# EAGLE design Termo-Relay (EAGLE 8.5.2)

## Sheet 1 of 2
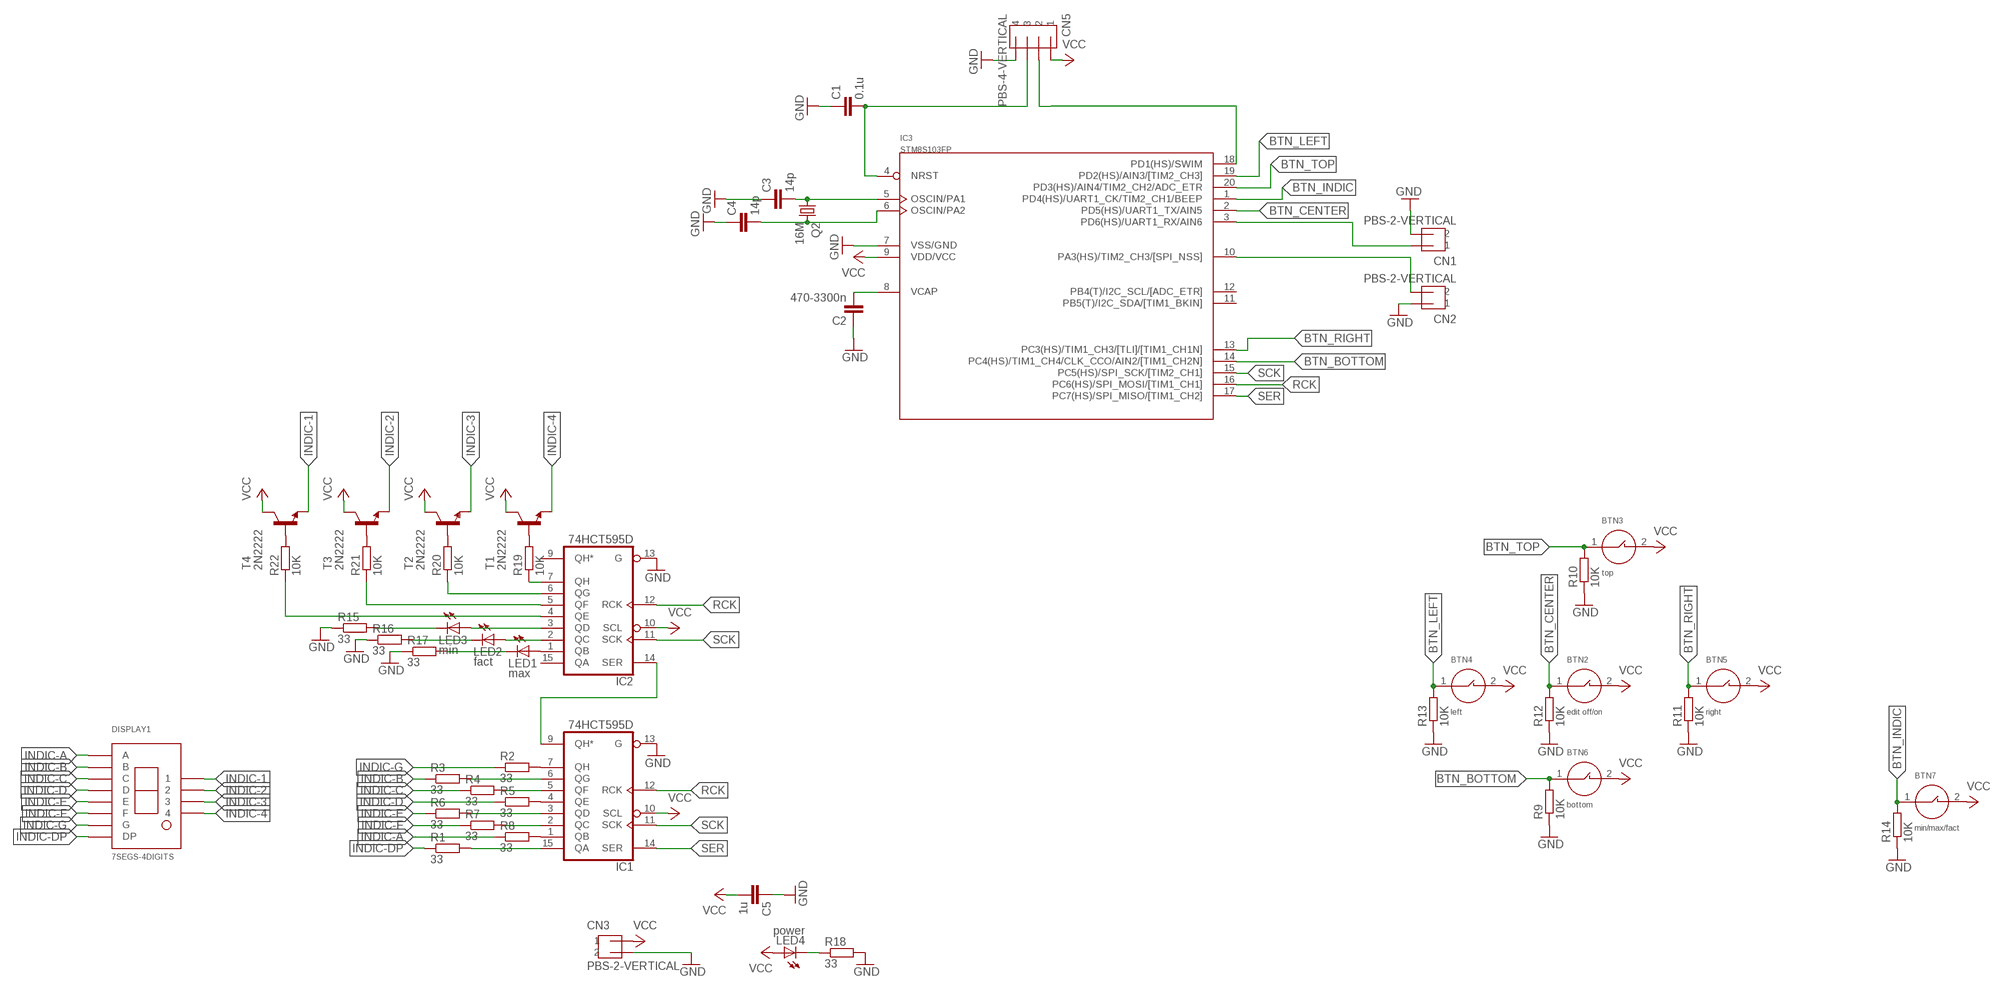
[diagram p0: schematic, sheet 1]

### Parts
BTN2  edit off/on  BTN-6X4-SMD  [BTN-6X4-SMD]
BTN3  top  BTN-6X4-SMD  [BTN-6X4-SMD]
BTN4  left  BTN-6X4-SMD  [BTN-6X4-SMD]
BTN5  right  BTN-6X4-SMD  [BTN-6X4-SMD]
BTN6  bottom  BTN-6X4-SMD  [BTN-6X4-SMD]
BTN7  min/max/fact  BTN-6X4-SMD  [BTN-6X4-SMD]
C1  0.1u  C-EUC0603  [C0603]
C2  470-3300n  C-EUC0603  [C0603]
C3  14p  C-EUC0603  [C0603]
C4  14p  C-EUC0603  [C0603]
C5  1u  C-EUC0603  [C0603]
CN1  PBS-2-VERTICAL  [PBS-2-VERTICAL]
CN2  PBS-2-VERTICAL  [PBS-2-VERTICAL]
CN3  PBS-2-VERTICAL  [PBS-2-VERTICAL]
CN5  PBS-4-VERTICAL  [PBS-4-VERTICAL]
DISPLAY1  7SEGS-4DIGITS  [7SEG-4DIGITS]
IC1  74HCT595D  [SO16]
IC2  74HCT595D  [SO16]
IC3  STM8S103FP  [TSSOP20]
LED1  max  LED3MM  [LED3MM]
LED2  fact  LED3MM  [LED3MM]
LED3  min  LED3MM  [LED3MM]
LED4  power  LED3MM  [LED3MM]
Q2  16M  CRYSTALHC49GW  [HC49GW]
R1  33  R-EU_R0603  [R0603]
R2  33  R-EU_R0603  [R0603]
R3  33  R-EU_R0603  [R0603]
R4  33  R-EU_R0603  [R0603]
R5  33  R-EU_R0603  [R0603]
R6  33  R-EU_R0603  [R0603]
R7  33  R-EU_R0603  [R0603]
R8  33  R-EU_R0603  [R0603]
R9  10K  R-EU_R0603  [R0603]
R10  10K  R-EU_R0603  [R0603]
R11  10K  R-EU_R0603  [R0603]
R12  10K  R-EU_R0603  [R0603]
R13  10K  R-EU_R0603  [R0603]
R14  10K  R-EU_R0603  [R0603]
R15  33  R-EU_R0603  [R0603]
R16  33  R-EU_R0603  [R0603]
R17  33  R-EU_R0603  [R0603]
R18  33  R-EU_R0603  [R0603]
R19  10K  R-EU_R0603  [R0603]
R20  10K  R-EU_R0603  [R0603]
R21  10K  R-EU_R0603  [R0603]
R22  10K  R-EU_R0603  [R0603]
T1  2N2222  MMBT2222ALT1-NPN-SOT23-BEC  [SOT23-BEC]
T2  2N2222  MMBT2222ALT1-NPN-SOT23-BEC  [SOT23-BEC]
T3  2N2222  MMBT2222ALT1-NPN-SOT23-BEC  [SOT23-BEC]
T4  2N2222  MMBT2222ALT1-NPN-SOT23-BEC  [SOT23-BEC]

### Nets
BTN_BOTTOM: BTN6.1 IC3.14(PC4(HS)/TIM1_CH4/CLK_CCO/AIN2/[TIM1_CH2N]) R9.2
BTN_CENTER: BTN2.1 IC3.2(PD5(HS)/UART1_TX/AIN5) R12.2
BTN_INDIC: BTN7.1 IC3.1(PD4(HS)/UART1_CK/TIM2_CH1/BEEP) R14.2
BTN_LEFT: BTN4.1 IC3.19(PD2(HS)/AIN3/[TIM2_CH3]) R13.2
BTN_RIGHT: BTN5.1 IC3.13(PC3(HS)/TIM1_CH3/[TLI]/[TIM1_CH1N]) R11.2
BTN_TOP: BTN3.1 IC3.20(PD3(HS)/AIN4/TIM2_CH2/ADC_ETR) R10.2
GND: C1.1 C2.1 C3.1 C4.1 C5.1 CN1.P$2 CN2.P$1 CN3.P$2 CN5.P$4 IC1.13(G) IC2.13(G) IC3.7(VSS/GND) R9.1 R10.1 R11.1 R12.1 R13.1 R14.1 R15.1 R16.1 R17.1 R18.2
INDIC-1: DISPLAY1.1 T4.E
INDIC-2: DISPLAY1.2 T3.E
INDIC-3: DISPLAY1.3 T2.E
INDIC-4: DISPLAY1.4 T1.E
INDIC-A: DISPLAY1.A R8.1
INDIC-B: DISPLAY1.B R3.1
INDIC-C: DISPLAY1.C R4.1
INDIC-D: DISPLAY1.D R5.1
INDIC-DP: DISPLAY1.DP R1.1
INDIC-E: DISPLAY1.E R6.1
INDIC-F: DISPLAY1.F R7.1
INDIC-G: DISPLAY1.G R2.1
N$1: IC1.9(QH*) IC2.14(SER)
N$2: R19.2 T1.B
N$3: R20.2 T2.B
N$4: R21.2 T3.B
N$5: R22.2 T4.B
N$6: IC2.3(QD) LED3.A
N$7: IC2.2(QC) LED2.A
N$8: IC2.1(QB) LED1.A
N$9: C4.2 IC3.6(OSCIN/PA2) Q2.2
N$10: IC1.6(QG) R3.2
N$11: IC1.7(QH) R2.2
N$12: IC1.5(QF) R4.2
N$13: IC1.4(QE) R5.2
N$14: IC1.3(QD) R6.2
N$15: IC1.2(QC) R7.2
N$16: IC1.1(QB) R8.2
N$17: CN5.P$2 IC3.18(PD1(HS)/SWIM)
N$18: CN1.P$1 IC3.3(PD6(HS)/UART1_RX/AIN6)
N$19: C1.2 CN5.P$3 IC3.4(NRST)
N$20: CN2.P$2 IC3.10(PA3(HS)/TIM2_CH3/[SPI_NSS])
N$21: C2.2 IC3.8(VCAP)
N$27: IC1.15(QA) R1.2
N$29: LED3.K(C) R15.2
N$31: LED2.K(C) R16.2
N$32: LED1.K(C) R17.2
N$33: C3.2 IC3.5(OSCIN/PA1) Q2.1
N$36: LED4.K(C) R18.1
N$37: IC2.7(QH) R19.1
N$38: IC2.6(QG) R20.1
N$39: IC2.5(QF) R21.1
N$40: IC2.4(QE) R22.1
RCK: IC1.12(RCK) IC2.12(RCK) IC3.16(PC6(HS)/SPI_MOSI/[TIM1_CH1])
SCK: IC1.11(SCK) IC2.11(SCK) IC3.15(PC5(HS)/SPI_SCK/[TIM2_CH1])
SER: IC1.14(SER) IC3.17(PC7(HS)/SPI_MISO/[TIM1_CH2])
VCC: BTN2.2 BTN3.2 BTN4.2 BTN5.2 BTN6.2 BTN7.2 C5.2 CN3.P$1 CN5.P$1 IC1.10(SCL) IC2.10(SCL) IC3.9(VDD/VCC) LED4.A T1.C T2.C T3.C T4.C
Unconnected: IC2.9(QH*) IC2.15(QA) IC3.11(PB5(T)/I2C_SDA/[TIM1_BKIN]) IC3.12(PB4(T)/I2C_SCL/[ADC_ETR])

## Sheet 2 of 2

## Power pins joined to a net without a drawn wire
GND: IC1.8(GND) IC2.8(GND)
VCC: IC1.16(VCC) IC2.16(VCC)

## Library data of the parts
BTN2-BTN7 = btn1:BTN-6X4-SMD
C1-C5 = resistor:C-EU: CAPACITOR, European symbol
CN1-CN3 = pls:PBS-2-VERTICAL
CN5 = pls:PBS-4-VERTICAL
DISPLAY1 = PK-7SegmentIndicator:7SEGS-4DIGITS
IC1 IC2 = 74xx-eu:74*595: 8-bit SHIFT REGISTER, output latch
IC3 = stm8s103:STM8S103F*: STM8S103F*
LED1-LED4 = led:LED: LED OSRAM: - CHIPLED LG R971, LG N971, LY N971, LG Q971, LY Q971, LO R971, LY R971 LH N974, LH R974 LS Q976, LO Q976, LY Q976 LO Q996 - Hyper CHIPLED LW Q18S LB Q993, LB Q99A, LB R99A - SideLED LS A670, LO A670, LY A670, LG A670, LP A670 LB A673, LV A673, LT A673, LW A673 LH A674 LY A675 LS A676, LA A676, LO A676, LY A676, LW A676 LS A679, LY A679, LG A679 - Hyper Micro SIDELED® LS Y876, LA Y876, LO Y876, LY Y876 LT Y87S - SmartLED LW L88C, LW L88S LB L89C, LB L89S, LG L890 LS L89K, LO L89K, LY L89K LS L896, LA L896, LO L896, LY L896 - TOPLED LS T670, LO T670, LY T670, LG T670, LP T670 LSG T670, LSP T670, LSY T670, LOP T670, LYG T670 LG T671, LOG T671, LSG T671 LB T673, LV T673, LT T673, LW T673 LH T674 LS T676, LA T676, LO T676, LY T676, LB T676, LH T676, LSB T676, LW T676 LB T67C, LV T67C, LT T67C, LS T67K, LO T67K, LY T67K, LW E67C LS E67B, LA E67B, LO E67B, LY E67B, LB E67C, LV E67C, LT E67C LW T67C LS T679, LY T679, LG T679 LS T770, LO T770, LY T770, LG T770, LP T770 LB T773, LV T773, LT T773, LW T773 LH T774 LS E675, LA E675, LY E675, LS T675 LS T776, LA T776, LO T776, LY T776, LB T776 LHGB T686 LT T68C, LB T68C - Hyper Mini TOPLED® LB M676 - Mini TOPLED Santana® LG M470 LS M47K, LO M47K, LY M47K Source: http://www.osram.convergy.de LUXEON: - LUMILED® LXK2-PW12-R00, LXK2-PW12-S00, LXK2-PW14-U00, LXK2-PW14-V00 LXK2-PM12-R00, LXK2-PM12-S00, LXK2-PM14-U00 LXK2-PE12-Q00, LXK2-PE12-R00, LXK2-PE12-S00, LXK2-PE14-T00, LXK2-PE14-U00 LXK2-PB12-K00, LXK2-PB12-L00, LXK2-PB12-M00, LXK2-PB14-N00, LXK2-PB14-P00, LXK2-PB14-Q00 LXK2-PR12-L00, LXK2-PR12-M00, LXK2-PR14-Q00, LXK2-PR14-R00 LXK2-PD12-Q00, LXK2-PD12-R00, LXK2-PD12-S00 LXK2-PH12-R00, LXK2-PH12-S00 LXK2-PL12-P00, LXK2-PL12-Q00, LXK2-PL12-R00 Source: www.luxeon.com KINGBRIGHT: KA-3528ASYC Source: www.kingbright.com
Q2 = crystal:CRYSTAL: CRYSTAL; OC_FARNELL: unknown; OC_NEWARK: unknown
R1-R22 = resistor:R-EU_: RESISTOR, European symbol
T1-T4 = transistor-neu-to92:*-NPN-: NPN Transistror

## Board
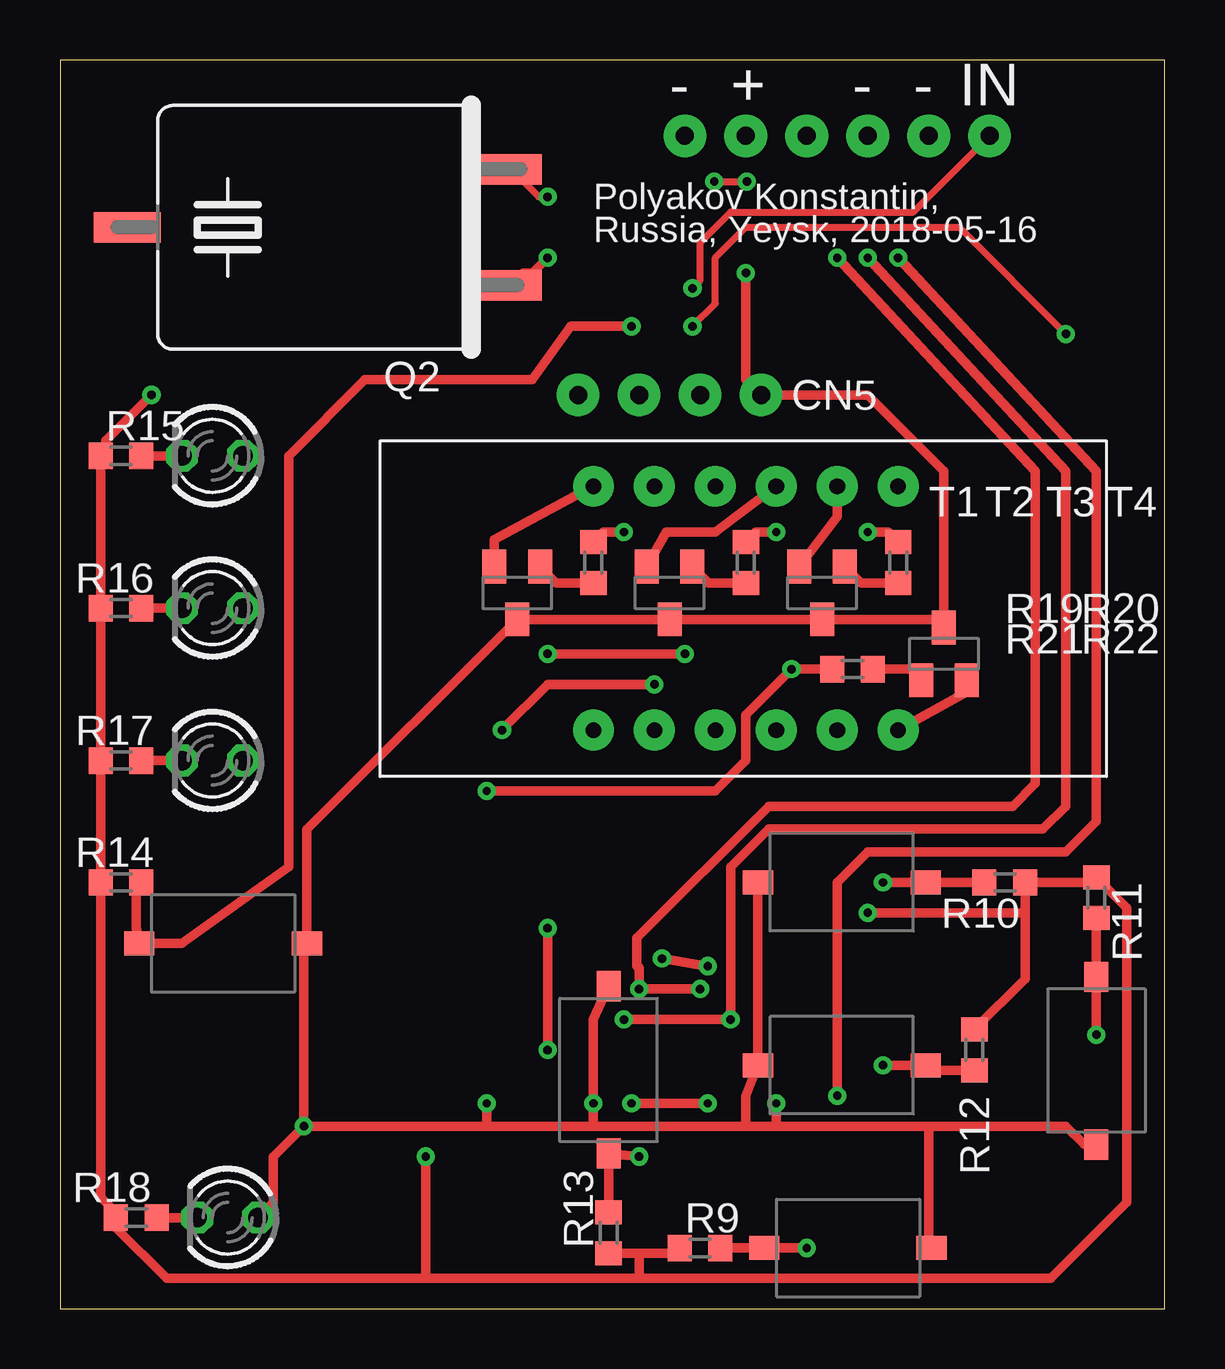
[diagram p1: board, top side]
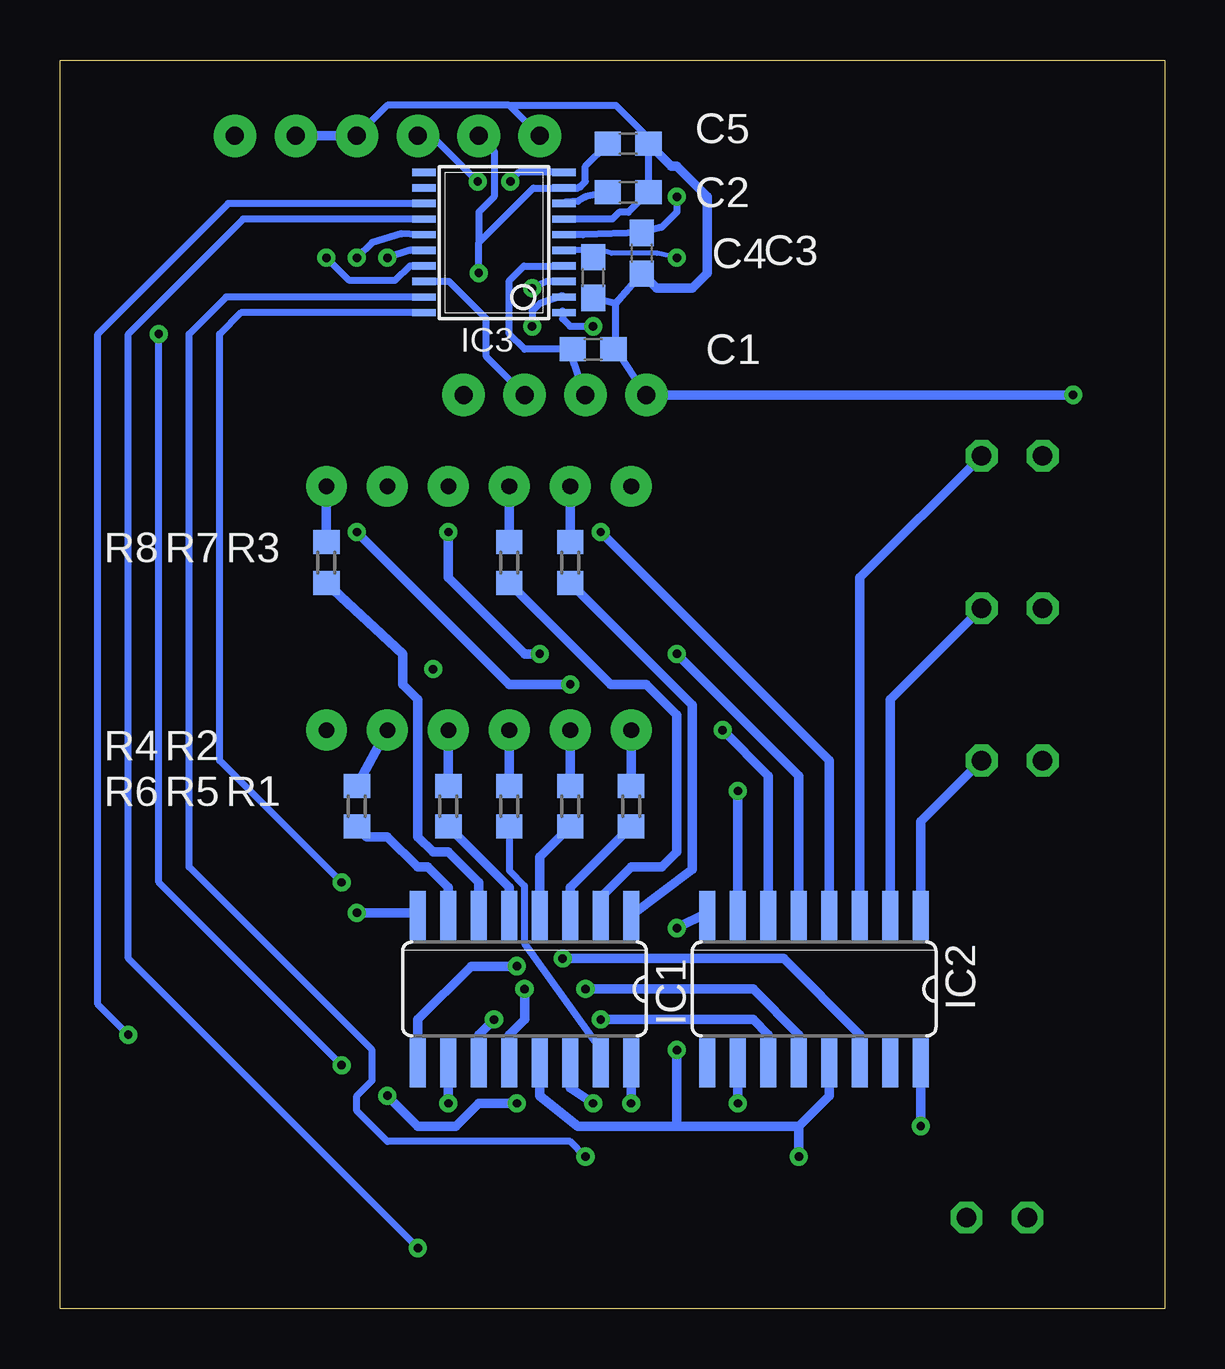
[diagram p2: board, bottom side, seen from below]

Size 46.02 x 52.06 mm. Coordinates in mm from the lower left corner, seen from the top.
Outline: 0,0 46.02,0 46.02,52.06 0,52.06 0,0
Copper layers (1*16): Top 0.035mm / dielectric 1.5mm / Bottom 0.035mm
Design rules "default *": minimum track width 5mil, minimum drill 0.3mm, track to track 6mil, track to pad 6mil, pad to pad 6mil, via to via 6mil, smd to smd 6mil, copper to edge 40mil, drill to drill 6mil, minimum pad ring 10mil, minimum via ring 8mil, stop-mask expansion 4mil, vias tented up to drill 0mil, thermal gap 10mil

### Footprints (pad centres in the part's own frame; a part is rotated, then mirrored left to right if it is on the bottom)
BTN-6X4-SMD = smd 1.25 x 1: 1 -0.508,0 | smd 1.27 x 1: 2 6.477,0
C0603 = smd 1.1 x 1: 1 -0.85,0; 2 0.85,0
PBS-2-VERTICAL = drill 0.75 pad 1.778: P$1 0,0; P$2 0,-2.54
PBS-4-VERTICAL = drill 0.75 pad 1.778: P$1 0,0; P$2 0,-2.54; P$3 0,-5.08; P$4 0,-7.62
7SEG-4DIGITS = drill 0.65 pad 1.7: 1 -5.08,-7.62; 2 -5.08,0; 3 -5.08,2.54; 4 5.08,5.08; A -5.08,-5.08; B -5.08,5.08; C 5.08,0; D 5.08,-5.08; DP 5.08,-2.54; E 5.08,-7.62; F -5.08,-2.54; G 5.08,2.54
SO16 = smd 0.66 x 2.032: 1 -4.445,-3.073; 2 -3.175,-3.073; 3 -1.905,-3.073; 4 -0.635,-3.073; 5 0.635,-3.073; 6 1.905,-3.073; 7 3.175,-3.073; 8 4.445,-3.073; 9 4.445,3.073; 10 3.175,3.073; 11 1.905,3.073; 12 0.635,3.073; 13 -0.635,3.073; 14 -1.905,3.073; 15 -3.175,3.073; 16 -4.445,3.073
TSSOP20 = smd 0.305 x 0.991: 1 -2.925,-2.918; 2 -2.275,-2.918; 3 -1.625,-2.918; 4 -0.975,-2.918; 5 -0.325,-2.918; 6 0.325,-2.918; 7 0.975,-2.918; 8 1.625,-2.918; 9 2.275,-2.918; 10 2.925,-2.918; 11 2.925,2.918; 12 2.275,2.918; 13 1.625,2.918; 14 0.975,2.918; 15 0.325,2.918; 16 -0.325,2.918; 17 -0.975,2.918; 18 -1.625,2.918; 19 -2.275,2.918; 20 -2.925,2.918
LED3MM = drill 0.813 octagon: A -1.27,0; K 1.27,0
HC49GW = smd 1.27 x 2.54: 1 -2.413,-8.001; 2 2.413,-8.001 | smd 1.27 x 2.794: 3 0,8.001
R0603 = smd 1 x 1.1: 1 -0.85,0; 2 0.85,0
SOT23-BEC = smd 1 x 1.4: B -0.95,-1.1; C 0,1.1; E 0.95,-1.1

### Placement (x,y rotation side)
BTN2  35.56,10.16 180 top
BTN3  35.56,17.78 180 top
BTN4  22.86,6.99 90 top
BTN5  43.18,13.34 270 top
BTN6  29.84,2.54 0 top
BTN7  3.81,15.24 0 top
C1  23.81,40.01 180 bottom
C2  22.35,46.55 180 bottom
C3  23.81,42.99 90 bottom
C4  21.78,44.01 90 bottom
C5  22.35,48.58 180 bottom
CN1  38.73,48.9 270 top
CN2  33.66,48.9 270 top
CN3  28.57,48.9 270 top
CN5  29.21,38.1 270 top
DISPLAY1  29.84,29.21 270 top
IC1  26.67,13.34 180 bottom
IC2  14.61,13.34 180 bottom
IC3  27.94,44.45 90 bottom
LED1  6.35,22.86 180 top
LED2  6.35,29.21 180 top
LED3  6.35,35.56 180 top
LED4  6.99,3.81 180 top
Q2  10.79,45.09 90 top
R1  27.3,20.95 270 bottom
R2  33.66,20.95 270 bottom
R3  34.92,31.11 270 bottom
R4  29.84,20.95 270 bottom
R5  24.77,20.95 270 bottom
R6  22.23,20.95 270 bottom
R7  27.3,31.11 270 bottom
R8  24.77,31.11 270 bottom
R9  26.67,2.54 0 top
R10  39.37,17.78 180 top
R11  43.18,17.14 270 top
R12  38.1,10.79 270 top
R13  22.86,3.17 90 top
R14  2.54,17.78 0 top
R15  2.54,35.56 0 top
R16  2.54,29.21 0 top
R17  2.54,22.86 0 top
R18  3.17,3.81 180 top
R19  33.02,26.67 0 top
R20  34.92,31.11 270 top
R21  28.57,31.11 270 top
R22  22.23,31.11 270 top
T1  36.83,27.3 0 top
T2  31.75,29.84 180 top
T3  25.4,29.84 180 top
T4  19.05,29.84 180 top

### Tracks (layer width: path | path; a pad name or v marks a point on that pad's centre or on a via)
BTN_BOTTOM  (via drill 0.35)
  Top 0.4: R9.2 BTN6.1 v31.11,2.54
  Bottom 0.3: v31.11,2.54 43.18,14.61 43.18,40.64 38.4,45.42 IC3.14
BTN_CENTER  (via drill 0.35)
  Top 0.3: v26.35,40.96 27.3,41.91 27.3,43.81 28.57,45.09 37.47,45.09 v41.91,40.64
  Top 0.4: R12.2 36.49,9.95 BTN2.1 v34.29,10.16
  Bottom 0.3: v34.29,10.16 41.91,17.78 v41.91,40.64 | IC3.2 25.07,42.23 26.04,41.91 26.35,41.59 v26.35,40.96
BTN_INDIC  (via drill 0.35)
  Top 0.4: R14.2 3.17,17.57 3.17,15.88 BTN7.1 5.08,15.24 9.53,18.41 9.53,35.56 12.7,38.73 19.68,38.73 21.27,40.96 v23.81,40.96
  Bottom 0.3: IC3.1 25.09,41.59 25.08,41.27 24.77,40.96 v23.81,40.96
BTN_LEFT  (via drill 0.35)
  Top 0.4: R13.2 BTN4.1 v24.13,6.35
  Bottom 0.3: v24.13,6.35 24.77,6.99 32.38,6.99 33.66,8.26 33.66,8.89 33.02,9.53 33.02,10.79 40.64,18.41 40.64,40.64 39.1,42.17 IC3.19
BTN_RIGHT  (via drill 0.35)
  Top 0.4: R11.2 BTN5.1 v43.18,11.43
  Bottom 0.3: v43.18,11.43 44.45,12.7 44.45,40.64 39.02,46.08 IC3.13
BTN_TOP  (via drill 0.35)
  Top 0.4: R10.2 BTN3.1 v34.29,17.78
  Bottom 0.3: v34.29,17.78 39.37,22.86 39.37,40.64 38.48,41.52 IC3.20
GND  (via drill 0.35)
  Top 0.4: R13.1 24.13,2.33 | 24.13,2.33 25.61,2.33 R9.1 | R12.1 40.22,13.77 40.22,16.51 | 40.22,16.51 R10.1 42.97,17.78 R11.1 44.45,16.73 44.45,4.45 41.27,1.27 24.13,1.27 | 24.13,1.27 15.24,1.27 | 15.24,1.27 4.45,1.27 2.33,3.39 R18.2 2.54,3.81 1.69,4.66 R14.1 R17.1 R16.1 R15.1 1.91,35.77 1.91,36.2 v3.81,38.1 | 24.13,2.33 24.13,1.27 | 40.22,16.51 v33.66,16.51 | v20.32,15.88 v20.32,10.79 | 15.24,1.27 v15.24,6.35
  Bottom 0.3: C4.1 22.86,41.91 | 22.86,41.91 C3.1 | CN5.P$4 22.86,40.01 | 22.86,40.01 22.86,41.91 | 22.86,40.01 C1.1 | IC3.7 23.01,45.42 22.72,45.71 22.34,45.71 C2.1 C5.1 21.5,48.81 22.86,50.16 27.3,50.16 | CN3.P$2 27.3,50.16 | 27.3,50.16 32.38,50.16 CN2.P$1
  Bottom 0.4: IC2.13 13.97,8.89 15.24,7.62 | 15.24,7.62 20.32,7.62 | 20.32,7.62 24.45,7.62 26.04,8.89 IC1.13 | CN2.P$1 CN1.P$2 | IC2.8 19.05,16.51 v20.32,15.88 | v33.66,16.51 31.22,16.51 IC1.8 | v20.32,10.79 20.32,7.62 | v15.24,6.35 15.24,7.62 | C4.1 21.17,42.55 19.68,42.55 19.05,43.18 19.05,46.35 20.32,47.62 20.55,47.62 C5.1 | CN5.P$4 v3.81,38.1
INDIC-1
  Top 0.4: DISPLAY1.1 18.1,32.07 T4.E
INDIC-2
  Top 0.4: T3.E 25.25,32.38 27.3,32.38 DISPLAY1.2
INDIC-3
  Top 0.4: T2.E 32.38,33.02 DISPLAY1.3
INDIC-4
  Top 0.4: T1.E 37.78,25.71 DISPLAY1.4
INDIC-A
  Bottom 0.4: R8.1 DISPLAY1.A
INDIC-B
  Bottom 0.4: R3.1 DISPLAY1.B
INDIC-C
  Bottom 0.4: R4.1 DISPLAY1.C
INDIC-D
  Bottom 0.4: R5.1 DISPLAY1.D
INDIC-DP
  Bottom 0.4: R1.1 DISPLAY1.DP
INDIC-E
  Bottom 0.4: R6.1 DISPLAY1.E
INDIC-F
  Bottom 0.4: R7.1 DISPLAY1.F
INDIC-G
  Bottom 0.4: R2.1 DISPLAY1.G
N$1  (via drill 0.35)
  Top 0.4: v25.08,14.61 v26.99,14.29
  Bottom 0.4: IC2.14 12.7,11.43 15.88,14.61 v25.08,14.61 | IC1.9 31.11,12.06 28.89,14.29 v26.99,14.29
N$2
  Top 0.4: T1.B 35.41,26.67 R19.2
N$3
  Top 0.4: T2.B 33.38,30.27 R20.2
N$4
  Top 0.4: T3.B 27.03,30.27 R21.2
N$5
  Top 0.4: T4.B 20.68,30.27 R22.2
N$6
  Bottom 0.4: LED3.A 12.7,30.48 IC2.3
N$7
  Bottom 0.4: LED2.A 11.43,25.4 IC2.2
N$8
  Bottom 0.4: LED1.A 10.16,20.32 IC2.1
N$9  (via drill 0.35)
  Top 0.3: Q2.2 19.94,46.35 v20.32,46.35
  Bottom 0.3: IC3.6 24.23,44.77 C4.2 21.8,44.87 20.95,45.09 20.32,45.72 v20.32,46.35
N$10
  Bottom 0.4: R3.2 31.75,27.3 31.75,26.04 31.11,25.4 31.11,19.68 30.48,19.05 29.84,19.05 28.57,17.78 IC1.6
N$11
  Bottom 0.4: R2.2 33.23,19.68 32.38,19.68 31.11,18.41 30.7,18.41 29.84,17.57 IC1.7
N$12
  Bottom 0.4: R4.2 27.3,17.57 IC1.5
N$13
  Bottom 0.4: R5.2 26.04,18.84 IC1.4
N$14
  Bottom 0.4: R6.2 24.77,17.57 IC1.3
N$15
  Bottom 0.4: R7.2 23.07,26.04 21.59,26.04 20.32,24.77 20.32,19.05 20.95,18.41 22.23,18.41 23.5,17.14 IC1.2
N$16
  Bottom 0.4: R8.2 19.68,25.18 19.68,18.31 IC1.1
N$17
  Bottom 0.3: CN5.P$2 28.26,39.69 28.26,41.27 29.81,42.83 IC3.18
N$18  (via drill 0.35)
  Top 0.3: v26.35,42.55 26.67,42.86 26.67,44.45 27.94,45.72 35.56,45.72 CN1.P$1
  Bottom 0.3: IC3.3 25.75,42.83 v26.35,42.55
N$19
  Bottom 0.3: CN5.P$3 24.66,39.59 C1.2 26.67,40.01 27.3,40.64 27.3,42.86 26.69,43.48 IC3.4
N$20  (via drill 0.35)
  Top 0.3: v27.26,46.99 v28.62,46.99
  Bottom 0.3: IC3.10 26.92,47.38 27.3,46.99 v27.26,46.99 | v28.62,46.99 30.53,48.9 CN2.P$2
N$21
  Bottom 0.3: C2.2 24.13,46.35 24.45,46.16 24.96,46.14 IC3.8
N$27
  Bottom 0.3: R1.2 27.3,18.28 26.67,17.64 26.67,15.24 23.5,10.79 IC1.15
N$29
  Top 0.4: LED3.K R15.2
N$31
  Top 0.4: R16.2 LED2.K
N$32
  Top 0.4: LED1.K R17.2
N$33  (via drill 0.35)
  Top 0.4: Q2.1 19.3,43.18 19.68,43.18 v20.32,43.81
  Bottom 0.2: v20.32,43.81 21.14,44.01 23.05,44.01 23.52,44.16 C3.2
  Bottom 0.25: C3.2 24.23,44.12 IC3.5
N$36
  Top 0.4: R18.1 LED4.K
N$37  (via drill 0.35)
  Top 0.4: R19.1 v30.48,26.67 28.57,24.77 28.57,22.86 27.3,21.59 v17.78,21.59
  Bottom 0.4: IC2.7 v17.78,21.59
N$38  (via drill 0.35)
  Top 0.4: R20.1 34.51,32.38 v33.66,32.38 | v18.41,24.13 20.32,26.04 v24.77,26.04
  Bottom 0.4: IC2.6 16.51,22.23 v18.41,24.13 | v24.77,26.04 27.3,26.04 v33.66,32.38
N$39  (via drill 0.35)
  Top 0.4: R21.1 29,32.38 v29.84,32.38 | v20.32,27.3 v26.04,27.3
  Bottom 0.4: IC2.5 15.24,22.23 v20.32,27.3 | v26.04,27.3 26.67,27.3 29.84,30.48 v29.84,32.38
N$40  (via drill 0.35)
  Top 0.4: R22.1 22.64,32.38 v23.5,32.38
  Bottom 0.4: v23.5,32.38 13.97,22.86 IC2.4
RCK  (via drill 0.35)
  Top 0.4: v26.67,13.34 v24.13,13.34 24.13,14.21 24.03,14.3 24.03,15.46 29.53,20.95 39.69,20.95 40.64,21.91 40.64,34.92 v32.38,43.81
  Bottom 0.3: IC3.16 31.43,44.12 v32.38,43.81
  Bottom 0.4: IC2.12 15.24,11.43 17.14,13.34 v24.13,13.34 | IC1.12 27.3,11.43 26.67,12.06 v26.67,13.34
SCK  (via drill 0.35)
  Top 0.4: v23.5,12.06 v27.94,12.06 27.94,18.41 29.53,20 40.96,20 41.91,20.95 41.91,34.92 v33.66,43.81
  Bottom 0.3: IC3.15 31.11,44.77 31.79,44.81 33.02,44.45 v33.66,43.81
  Bottom 0.4: IC2.11 16.51,11.43 17.14,12.06 v23.5,12.06 | v27.94,12.06 28.57,11.43 IC1.11
SER  (via drill 0.35)
  Top 0.4: v34.92,43.81 43.18,34.92 43.18,20.32 41.91,19.05 33.66,19.05 32.38,17.78 v32.38,8.89 | v23.81,8.57 v26.99,8.57
  Bottom 0.3: IC3.17 31.45,43.48 32.07,42.86 33.97,42.86 v34.92,43.81
  Bottom 0.4: v23.81,8.57 24.77,9.21 IC1.14 | v26.99,8.57 28.57,8.57 29.53,7.62 31.11,7.62 v32.38,8.89
VCC  (via drill 0.35)
  Top 0.4: BTN3.2 BTN2.2 28.57,8.89 28.57,7.62 | BTN6.2 36.2,2.67 36.2,7.62 | 36.2,7.62 41.91,7.62 42.67,6.86 BTN5.2 | LED4.A 8.89,4.45 8.89,6.35 v10.16,7.62 | 36.83,28.57 36.53,28.57 36.37,28.75 T2.C T3.C T4.C 10.29,19.98 BTN7.2 | 10.29,15.11 BTN7.2 | v10.16,7.62 17.78,7.62 | 17.78,7.62 22.23,7.62 | 22.23,7.62 28.57,7.62 | BTN4.2 22.83,13.43 22.56,12.8 22.23,12.06 v22.23,8.57 22.23,7.62 | 17.78,7.62 v17.78,8.57 | v29.84,8.57 29.84,7.62 | 29.84,7.62 28.57,7.62 | BTN7.2 10.16,15.11 v10.16,7.62 | 29.84,7.62 36.2,7.62 | T1.C 36.83,28.57 | 36.83,28.57 36.83,34.92 33.66,38.1 CN5.P$1 28.57,38.73 v28.57,43.18
  Bottom 0.3: 23.5,48.87 C5.2 23.2,48.55 24.13,47.62 24.13,46.99 24.35,46.77 24.39,46.77 24.44,46.73 IC3.9 26.3,46.73 28.57,44.45 | v28.57,43.18 28.57,44.45 | CN3.P$1 27.94,48.26 27.94,46.35 28.57,45.72 28.57,44.45
  Bottom 0.4: IC2.16 v10.16,7.62 | IC2.10 v17.78,8.57 | IC1.16 v22.23,8.57 | IC1.10 v29.84,8.57

### Text on the board
tNames: - | + | - | - | IN | Polyakov Konstantin, / Russia, Yeysk, 2018-05-16